# Altium schematic sheet 1_P1.schdoc
size 309 x 223 mm; Symbol: Sheet-Symbol_A4; Device: Sheet-Symbol_A4; Company: 嘉立创EDA; Version: V1.0; Page Size: A4; @Project Name: Smart_medcilTEST; @Page Count: 1; @Update Date: 2024-12-30; @Create Date: 2024-12-29; @Schematic Name: Schematic1; @Page No: 1; @Page Name: P1; @Board Name: Board1; @Create Time: 21:56:48; @Update Time: 21:56:48
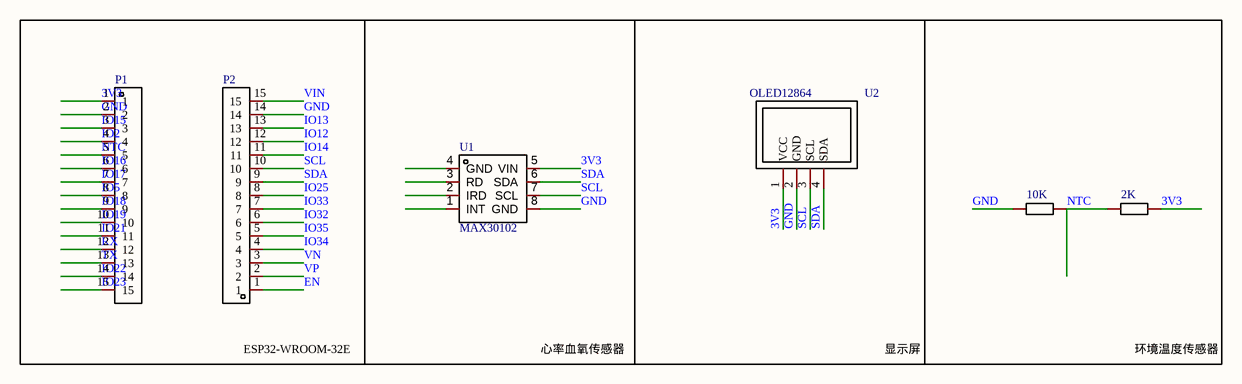
[diagram p0: 1_P1.schdoc]

## Parts
2K  10K插件电阻  [RES-TH_BD2.3-L6.5-P10.50-D0.5]  (value not drawn)
10K  10K  [footprint_c2d9]  (value not drawn)
P1  排针15pin  [排针15PIN]  (value not drawn)
P2  排针15pin  [排针15PIN]  (value not drawn)
U1  MAX30102  [MAX30102]  (value not drawn)
U2  OLED12864  [OLED12864模块I2C]  (value not drawn)

## Blocks framed on the sheet
ESP32-WROOM-32E: P1 P2
心率血氧传感器: U1
显示屏: U2
环境温度传感器: 2K 10K

## Nets
3V3: 2K.2 P1.1 U1.5(VIN) U2.1(VCC)
EN: P2.1
GND: 10K.1 P1.2 P2.14 U1.8(GND) U2.2(GND)
IO2: P1.4
IO5: P1.8
IO12: P2.12
IO13: P2.13
IO14: P2.11
IO15: P1.3
IO16: P1.6
IO17: P1.7
IO18: P1.9
IO19: P1.10
IO21: P1.11
IO22: P1.14
IO23: P1.15
IO25: P2.8
IO32: P2.6
IO33: P2.7
IO34: P2.4
IO35: P2.5
NTC: 2K.1 10K.2 P1.5
RX: P1.12
SCL: P2.10 U1.7(SCL) U2.3(SCL)
SDA: P2.9 U1.6(SDA) U2.4(SDA)
TX: P1.13
VIN: P2.15
VN: P2.3
VP: P2.2

Not connected (* = marked no-connect by the designer): U1 1(INT) 2(IRD) 3(RD) 4(GND)

## Notes on the sheet
- 1
- 2
- 3
- 4
- 5
- 6
- A
- B
- C
- 原理图
- Schematic1
- 创建日期
- 更新日期
- 2024-12-30
- 2024-12-29
- 审阅
- 绘制
- 图页
- P1
- 物料编码
- Smart_medcilTEST
- D
- 版本
- 尺寸
- 页
- 共
- V1.0
- A4
- 嘉立创EDA

## Library data of the parts
2K = 10K插件电阻: Symbol: CR-L3W-10ΩJ; Convert to PCB: yes; Device: 10K插件电阻; Add into BOM: yes
10K = 10K: Manufacturer: UniOhm; Manufacturer Part: 0603WAF1002T5E; Add into BOM: yes; Symbol: 10K; Device: 10K; Convert to PCB: yes; Supplier: LCSC; Supplier Part: C25804
P1 P2 = 排针15pin: Add into BOM: yes; Symbol: 排针15pin; Device: 排针15pin; Convert to PCB: yes; Origin Footprint 2: 排针15PIN
U1 = MAX30102: Add into BOM: yes; _: 3; Symbol: MAX30102; Device: MAX30102; Convert to PCB: yes
U2 = OLED12864: Add into BOM: yes; Symbol: OLED12864; Device: OLED12864; Convert to PCB: yes